# Altium schematic sheet LPFilter.SchDoc: Differential 7th order LP Filter Sch
size A; DrawnBy: Enrique Morell; DocumentNumber: 5; SheetNumber: 5; SheetTotal: 9
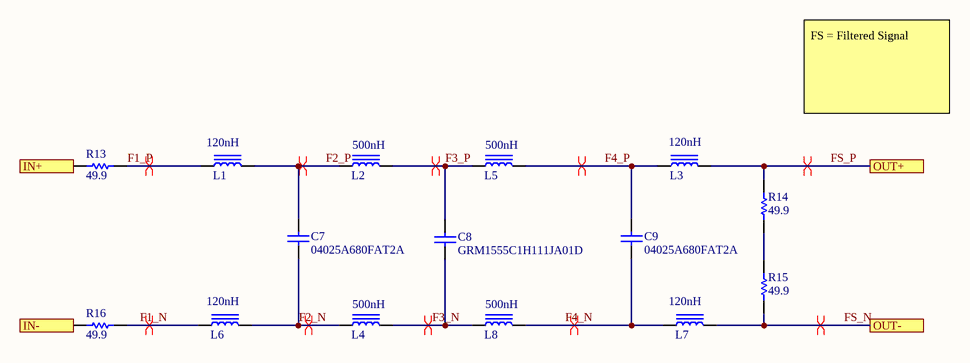
[diagram p0: LPFilter.SchDoc]

## Parts
C7  04025A680FAT2A  [CAPC1005X56X25NL10T15]
C8  GRM1555C1H111JA01D  [CAPC1005X55X25LL05T10]
C9  04025A680FAT2A  [CAPC1005X56X25NL10T15]
L1  120nH  [FER 0805/2012]
L2  500nH  [CAP 1210/3225 - 1.2MM]
L3  120nH  [FER 0805/2012]
L4  500nH  [CAP 1210/3225 - 1.2MM]
L5  500nH  [CAP 1210/3225 - 1.2MM]
L6  120nH  [FER 0805/2012]
L7  120nH  [FER 0805/2012]
L8  500nH  [CAP 1210/3225 - 1.2MM]
R13  49.9  [RESC1005X40X25NL05T05]
R14  49.9  [RESC1005X40X25NL05T05]
R15  49.9  [RESC1005X40X25NL05T05]
R16  49.9  [RESC1005X40X25NL05T05]

## Ports
IN+, IN-, OUT+, OUT-

## Nets
F1_N: L6.1 R16.2
F1_P: L1.1 R13.2
F2_N: C7.2 L4.1 L6.2
F2_P: C7.1 L1.2 L2.1
F3_N: C8.1 L4.2 L8.1
F3_P: C8.2 L2.2 L5.1
F4_N: C9.1 L7.1 L8.2
F4_P: C9.2 L3.1 L5.2
FS_N: L7.2 R15.1 ; port OUT-
FS_P: L3.2 R14.2 ; port OUT+
IN+: R13.1 ; port IN+
IN-: R16.1 ; port IN-
NetR14_1: R14.1 R15.2

## Layout directives
differential pair: F1_N, F1_P, F2_N, F2_P, F3_N, F3_P, F4_N, F4_P, FS_N, FS_P

## Notes on the sheet
- FS = Filtered Signal

## Library data of the parts
C7 C9 = CMP-2008-02674-1: Manufacturer: AVX Interconnect / Elco; Part Number: 04025A680FAT2A
C8 = CMP-2008-04257-1: Manufacturer: Murata; Part Number: GRM1555C1H111JA01D
L1 L3 L6 L7 = MLF2012DR12M: FIXED IND 120NH 300MA 200 MOHM; Manufacturer: TDK Corporation; TemperatureRange: -55°C ~ 125°C; Tolerance: 20%; Type: Multilayer; Q at Frequency: 20 @ 25MHz; DC Resistance: 200mOhm Max; Shielding: Shielded; ComponentLink2Description: Digi-Key listing; ComponentLink1URL: https://product.tdk.com/info/en/catalog/datasheets/inductor_commercial_standard_mlf2012_en.pdf; ComponentLink1Description: Datasheet; ComponentLink2URL: https://www.digikey.com/product-detail/en/tdk-corporation/MLF2012DR12M/445-8984-1-ND/3641578; Value: 120nH; Part Number: MLF2012DR12M; PartId: 6444; Supplier 1: Digi-Key; Supplier Part Number 1: 445-8984-1-ND; Price: 0.18; Device Package: 0805 (2012 Metric)
L2 L4 L5 L8 = 74479899150: FIXED IND 500NH 3.8A 18 MOHM SMD; Manufacturer: Wurth Electronics Inc.; TemperatureRange: -40°C ~ 125°C; Tolerance: 20%; Type: Multilayer; Q at Frequency: 22 @ 1MHz; DC Resistance: 18mOhm; Shielding: Shielded; Value: 500nH; Part Number: 74479899150; PartId: 6443; Supplier 1: Digi-Key; Supplier Part Number 1: 732-7339-6-ND; ComponentLink1Description: Datasheet; ComponentLink1URL: https://katalog.we-online.de/pbs/datasheet/74479899150.pdf; ComponentLink2Description: Digi-Key listing; ComponentLink2URL: https://www.digikey.com/product-detail/en/wurth-electronics-inc/74479899150/732-7339-6-ND/5353481; Price: 1.13; Device Package: 1210 (3225 Metric)
R13-R16 = CMP-2002-00969-1: Manufacturer: Panasonic; Part Number: ERJ-2RKF49R9X